# EAGLE schematic 1117_3.3V (EAGLE 7.5.0)
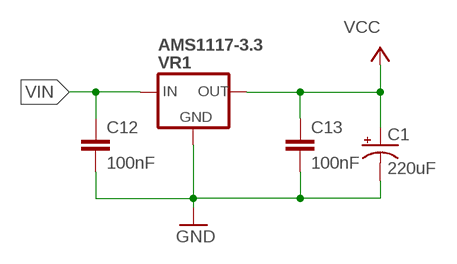
[diagram p0: schematic, sheet 1]

## Parts
C1  220uF  CPOL-USUD-6,3X7,7  [UD-6,3X7,7_NICHICON]
C12  100nF  C-EUC0805  [C0805]
C13  100nF  C-EUC0805  [C0805]
VR1  AMS1117-3.3  NCP1117ST50T3G  [SOT223]

## Nets
GND: C1.- C12.2 C13.2 VR1.1(GND)
VCC: C1.+ C13.1 VR1.2(OUT) VR1.4(OUT)
VIN: C12.1 VR1.3(IN)

## Library data of the parts
C1 = rcl:CPOL-US: POLARIZED CAPACITOR, American symbol
C12 C13 = rcl:C-EU: CAPACITOR, European symbol
VR1 = PatternAgents-OnSemi:NCP1117ST50T3G: NCP1117ST50T3G - 3 Terminal 5.0V LDO

## Net classes
1 vcc: width 0.254 mm